# EAGLE design nrf51822-button (EAGLE 7.1.0)
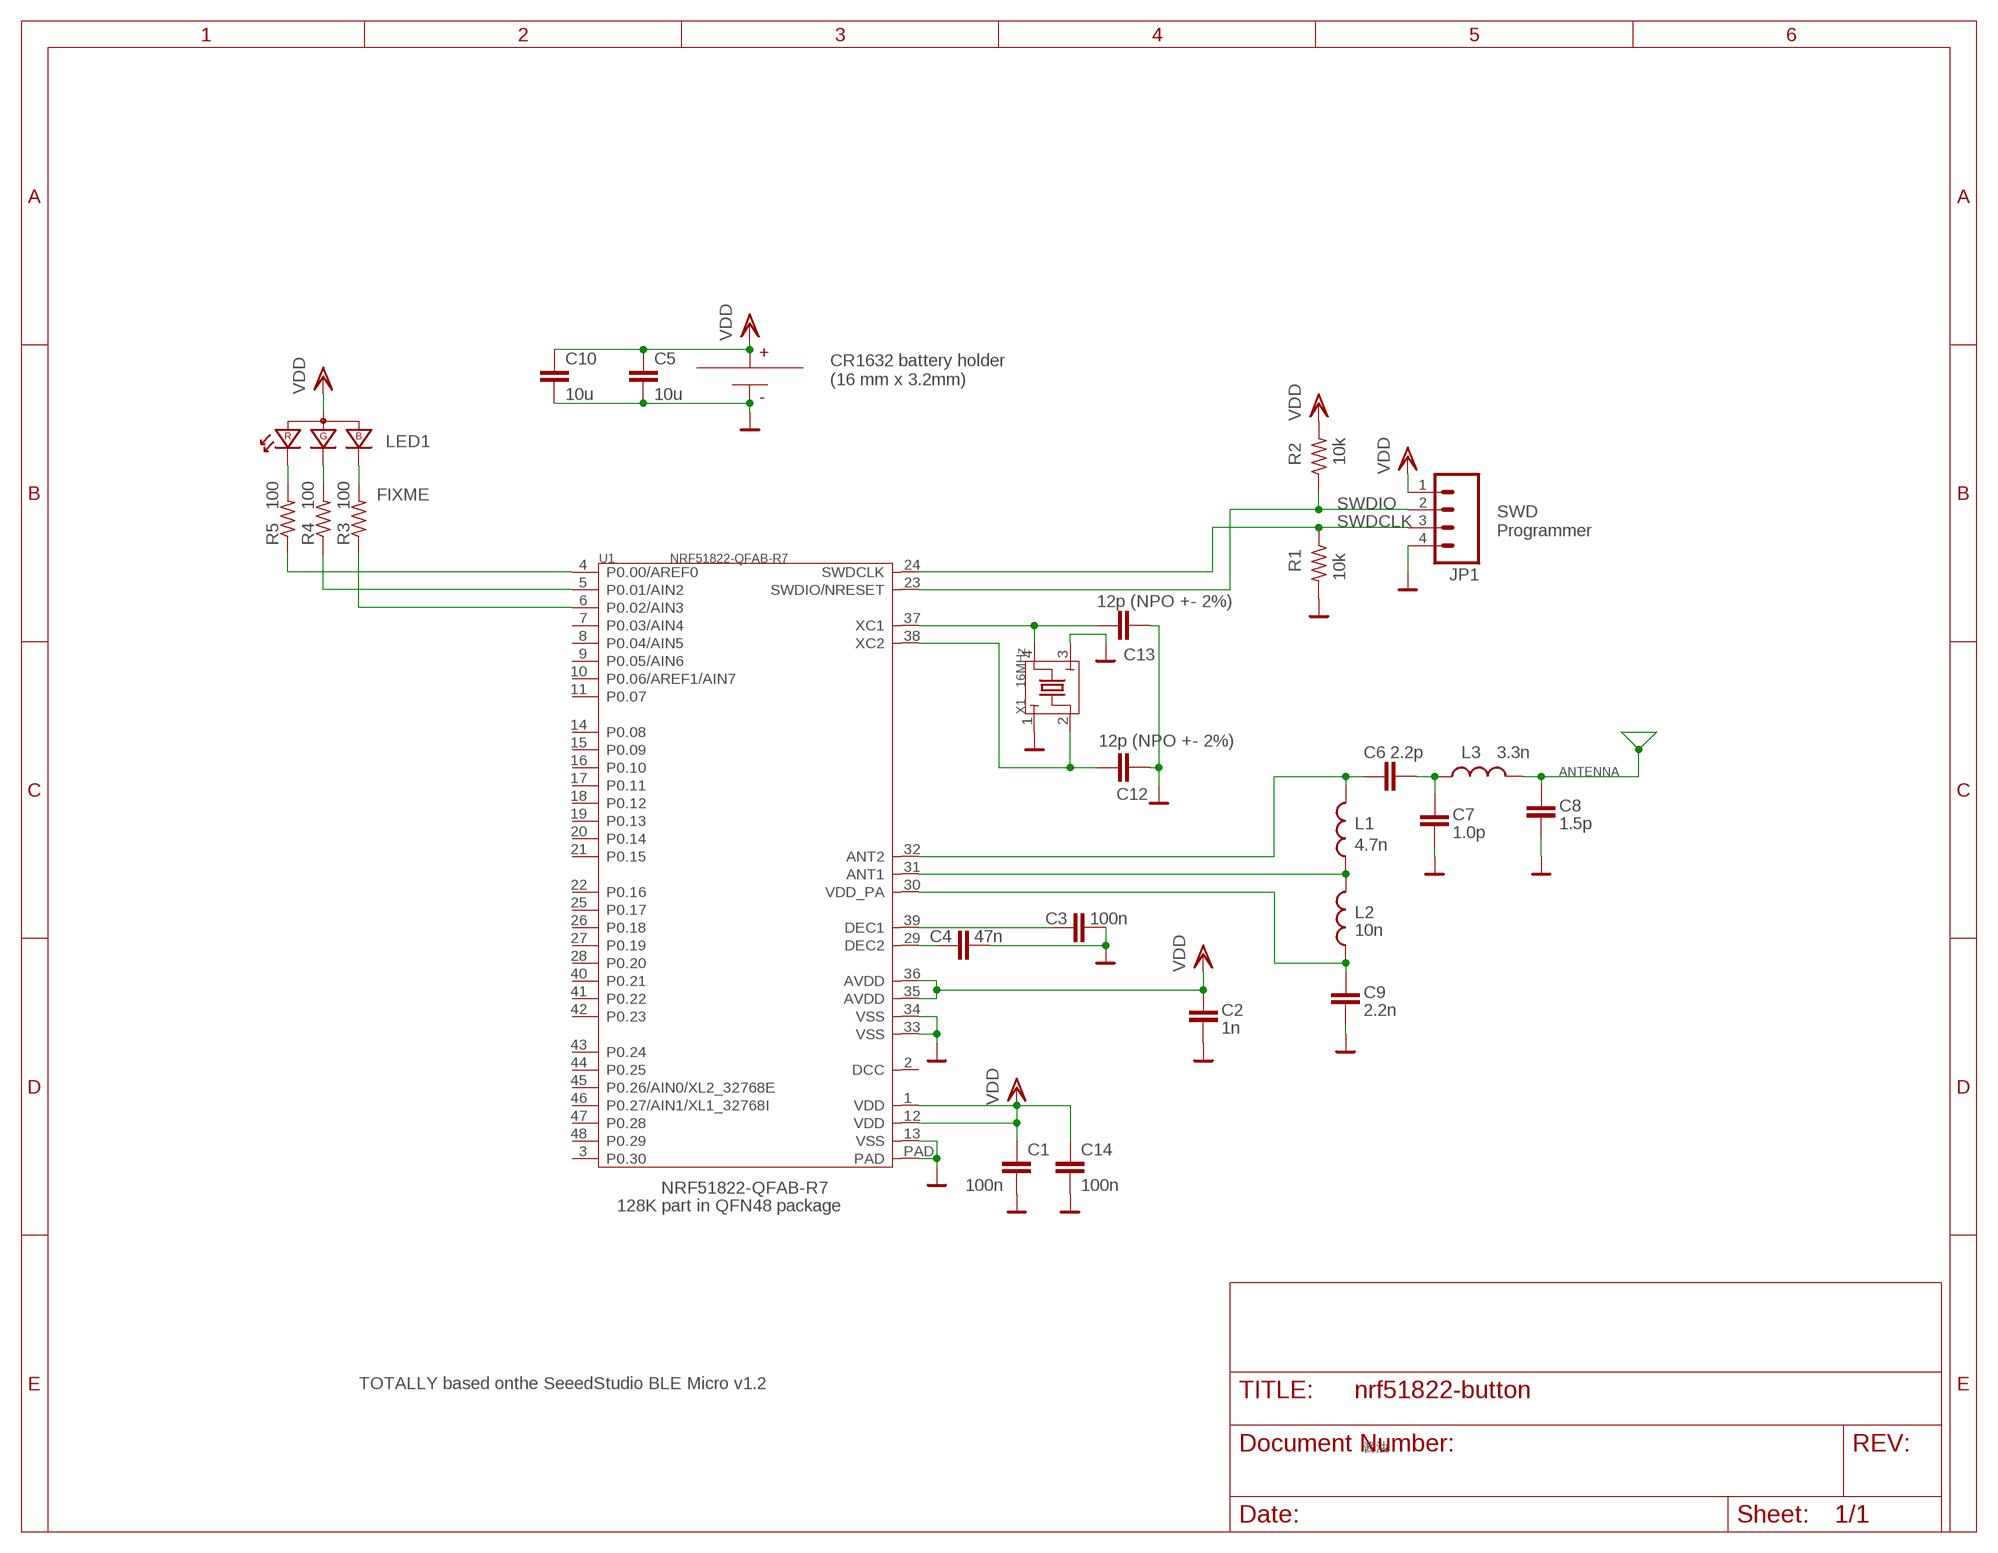
[diagram p0: schematic, sheet 1]

## Parts
B1  CON-COINCEL-HOLDER-KEYSTONE-3012TR  [16MM-COINCELL-KEYSTONE]
C1  100n  C-EU0402-C-NOSILK  [.0402-C-NOSILK]
C2  1n  C-EU0402-C-NOSILK  [.0402-C-NOSILK]
C3  100n  C-EU0402-C-NOSILK  [.0402-C-NOSILK]
C4  47n  C-EU0402-C-NOSILK  [.0402-C-NOSILK]
C5  10u  C-EU0805-B-NOSILK  [.0805-B-NOSILK]
C6  2.2p  C-EU0402-C-NOSILK  [.0402-C-NOSILK]
C7  1.0p  C-EU0402-C-NOSILK  [.0402-C-NOSILK]
C8  1.5p  C-EU0402-C-NOSILK  [.0402-C-NOSILK]
C9  2.2n  C-EU0402-C-NOSILK  [.0402-C-NOSILK]
C10  10u  C-EU0805-B-NOSILK  [.0805-B-NOSILK]
C12  12p (NPO +- 2%)  C-EU0402-C-NOSILK  [.0402-C-NOSILK]
C13  12p (NPO +- 2%)  C-EU0402-C-NOSILK  [.0402-C-NOSILK]
C14  100n  C-EU0402-C-NOSILK  [.0402-C-NOSILK]
JP1  M041.27MM  [1X04-1.27MM]
L1  4.7n  L-US0402-C-NOSILK  [.0402-C-NOSILK]
L2  10n  L-US0402-C-NOSILK  [.0402-C-NOSILK]
L3  3.3n  L-US0402-C-NOSILK  [.0402-C-NOSILK]
LED1  LED_RGB_COMMON_ANODE-1.6X1.26  [KINGBRITE_RGBLED_1.6X1.26]
R1  10k  R-US_0402-C-NOSILK  [.0402-C-NOSILK]
R2  10k  R-US_0402-C-NOSILK  [.0402-C-NOSILK]
R3  100  R-US_0402-C-NOSILK  [.0402-C-NOSILK]
R4  100  R-US_0402-C-NOSILK  [.0402-C-NOSILK]
R5  100  R-US_0402-C-NOSILK  [.0402-C-NOSILK]
U1  NRF51822-QFAB-R7  NRF51822  [QFN48-6X6MM]
X1  16MHz  CRYSTAL'-2520'  [2520]

## Nets
ANTENNA: C8.2 L3.2
GND: B1.NEG C1.2 C2.2 C3.2 C4.2 C5.2 C7.1 C8.1 C9.2 C10.2 C12.2 C13.2 C14.2 JP1.4 R1.2 U1.13(VSS) U1.33(VSS) U1.34(VSS) U1.PAD X1.1 X1.3
N$1: R5.1 U1.4(P0.00/AREF0)
N$2: R4.1 U1.5(P0.01/AIN2)
N$3: R3.1 U1.6(P0.02/AIN3)
N$4: LED1.3(RK) R5.2
N$5: LED1.4(GK) R4.2
N$7: LED1.1(BK) R3.2
N$17: C13.1 U1.37(XC1) X1.4
N$18: C12.1 U1.38(XC2) X1.2
N$19: C3.1 U1.39(DEC1)
N$20: C4.1 U1.29(DEC2)
N$21: C6.1 L1.2 U1.32(ANT2)
N$25: L1.1 L2.2 U1.31(ANT1)
N$26: C9.1 L2.1 U1.30(VDD_PA)
N$28: C6.2 C7.2 L3.1
SWDCLK: JP1.3 R1.1 U1.24(SWDCLK)
SWDIO: JP1.2 R2.1 U1.23(SWDIO/NRESET)
VDD: B1.POS@1(POS) B1.POS@2(POS) C1.1 C2.1 C5.1 C10.1 C14.1 JP1.1 LED1.2(COMMON_ANODE) R2.2 U1.1(VDD) U1.12(VDD) U1.35(AVDD) U1.36(AVDD)
Unconnected: U1.2(DCC) U1.3(P0.30) U1.7(P0.03/AIN4) U1.8(P0.04/AIN5) U1.9(P0.05/AIN6) U1.10(P0.06/AREF1/AIN7) U1.11(P0.07) U1.14(P0.08) U1.15(P0.09) U1.16(P0.10) U1.17(P0.11) U1.18(P0.12) U1.19(P0.13) U1.20(P0.14) U1.21(P0.15) U1.22(P0.16) U1.25(P0.17) U1.26(P0.18) U1.27(P0.19) U1.28(P0.20) U1.40(P0.21) U1.41(P0.22) U1.42(P0.23) U1.43(P0.24) U1.44(P0.25) U1.45(P0.26/AIN0/XL2_32768E) U1.46(P0.27/AIN1/XL1_32768I) U1.47(P0.28) U1.48(P0.29)

## Notes on the sheet
- CR1632 battery holder
  (16 mm x 3.2mm)
- FIXME
- SWD
  Programmer
- NRF51822-QFAB-R7
- 128K part in QFN48 package
- TOTALLY based onthe SeeedStudio BLE Micro v1.2
- 酱油

## Library data of the parts
B1 = 16mm-coincell-keystone:CON-COINCEL-HOLDER-KEYSTONE-3012TR
C1-C10 C12-C14 = rcl_custom:C-EU: CAPACITOR, European symbol
JP1 = SparkFun-v5:M04: Header 4 Standard 4-pin 0.1" header. Use with straight break away headers (SKU : PRT-00116), right angle break away headers (PRT-00553), swiss pins (PRT-00743), machine pins (PRT-00117), and female headers (PRT-00115). Molex polarized connector foot print use with SKU : PRT-08231 with associated crimp pins and housings. 1MM SMD Version SKU: PRT-10208
L1-L3 = rcl_custom:L-US: INDUCTOR, American symbol
LED1 = apdm_alt:LED_RGB_COMMON_ANODE-*: RGB LED with comon anode
R1-R5 = rcl_custom:R-US_: RESISTOR, American symbol
U1 = AMLib:NRF51822: Multi-protocol Blutooth 4.0 low energy /2. GHz RF SoC
X1 = AMLib:CRYSTAL

## Net classes
0 default: width 0.102 mm, drill 0.203 mm, clearance 0.102 mm

## Board
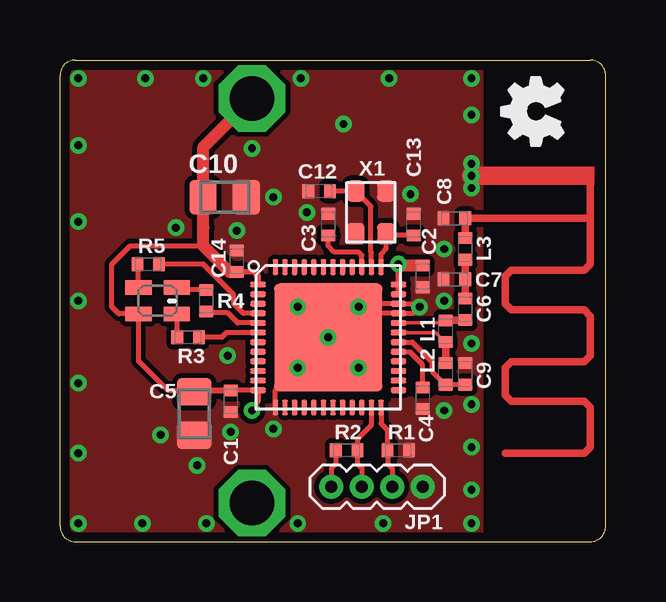
[diagram p1: board, top side]
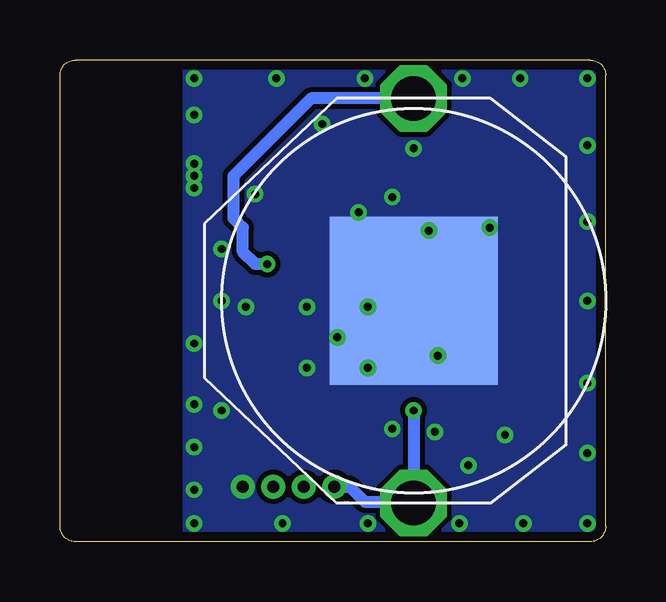
[diagram p2: board, bottom side, seen from below]

Size 22.73 x 20.07 mm. Coordinates in mm from the lower left corner, seen from the top.
Outline: 0.64,0 22.1,0 arc90 22.73,0.64 22.73,19.43 arc90 22.1,20.07 0.64,20.07 arc90 0,19.43 0,0.64 arc90 0.64,0
Copper layers (1*16): Top 0.0356mm / dielectric 1.5011mm / Bottom 0.0356mm
Design rules "OSH-Park-2-layer *": minimum track width 6mil, minimum drill 13mil, track to track 6mil, track to pad 6mil, pad to pad 6mil, via to via 6mil, smd to smd 6mil, copper to edge 15mil, drill to drill 6mil, minimum pad ring 7mil, minimum via ring 7mil, stop-mask expansion 3mil, vias tented up to drill 0mil, thermal gap 10mil
tRestrict: area 8.6,6 to 13.6,10.9; area 13.7,9.5 to 14.5,9.9

### Footprints (pad centres in the part's own frame; a part is rotated, then mirrored left to right if it is on the bottom)
16MM-COINCELL-KEYSTONE = smd 7 x 7: NEG 0,0 | drill 1.85 octagon: POS@1 -8.433,0; POS@2 8.433,0
.0402-C-NOSILK = smd 0.5 x 0.6: 1 -0.45,0; 2 0.45,0
.0805-B-NOSILK = smd 1.15 x 1.45: 1 -0.9,0; 2 0.9,0
1X04-1.27MM = drill 0.508 pad 1: 1 0,0; 2 1.27,0; 3 2.54,0; 4 3.81,0
KINGBRITE_RGBLED_1.6X1.26 = smd 1.1 x 0.6: 1 0.8,-0.55; 2 -0.8,-0.55; 3 -0.8,0.55; 4 0.8,0.55
QFN48-6X6MM = smd 0.23 x 0.65: 1 -2.2,-2.925; 2 -1.8,-2.925; 3 -1.4,-2.925; 4 -1,-2.925; 5 -0.6,-2.925; 6 -0.2,-2.925; 7 0.2,-2.925; 8 0.6,-2.925; 9 1,-2.925; 10 1.4,-2.925; 11 1.8,-2.925; 12 2.2,-2.925; 25 2.2,2.925; 26 1.8,2.925; 27 1.4,2.925; 28 1,2.925; 29 0.6,2.925; 30 0.2,2.925; 31 -0.2,2.925; 32 -0.6,2.925; 33 -1,2.925; 34 -1.4,2.925; 35 -1.8,2.925; 36 -2.2,2.925 | smd 0.65 x 0.23: 13 2.925,-2.2; 14 2.925,-1.8; 15 2.925,-1.4; 16 2.925,-1; 17 2.925,-0.6; 18 2.925,-0.2; 19 2.925,0.2; 20 2.925,0.6; 21 2.925,1; 22 2.925,1.4; 23 2.925,1.8; 24 2.925,2.2; 37 -2.925,2.2; 38 -2.925,1.8; 39 -2.925,1.4; 40 -2.925,1; 41 -2.925,0.6; 42 -2.925,0.2; 43 -2.925,-0.2; 44 -2.925,-0.6; 45 -2.925,-1; 46 -2.925,-1.4; 47 -2.925,-1.8; 48 -2.925,-2.2 | smd 4.5 x 4.5: PAD 0,0
2520 = smd 0.889 x 0.762: 1 -0.889,0.635; 2 -0.889,-0.635; 3 0.889,-0.635; 4 0.889,0.635

### Placement (x,y rotation side)
B1  8,10.03 270 bottom
C1  7.11,5.84 270 top
C2  15.11,11.05 270 top
C3  11.18,13.21 90 top
C4  15.11,5.97 270 top
C5  5.59,5.33 270 top
C6  16.89,9.68 90 top
C7  16.43,10.92 0 top
C8  16.43,13.46 0 top
C9  16.89,6.99 90 top
C10  6.86,14.35 0 top
C12  10.79,14.61 180 top
C13  14.73,13.21 90 top
C14  7.37,11.68 90 top
JP1  11.3,2.29 0 top
L1  16.07,8.76 90 top
L2  16.07,6.99 90 top
L3  16.89,12.19 90 top
LED1  4.06,10.03 0 top
R1  14.1,3.81 0 top
R2  11.94,3.81 180 top
R3  5.33,8.51 180 top
R4  6.1,10.03 90 top
R5  3.68,11.56 180 top
U1  11.18,8.51 270 top
U$31  [OSHW_FILLX100_NOTEXT]  20.95,16.51 90 top
X1  12.95,13.72 270 top

### Tracks (layer width: path | path; a pad name or v marks a point on that pad's centre or on a via)
ANTENNA
  Top 0.305: C8.2 19.3,13.46 | C8.2 L3.2 | C8.2 22.1,13.46 | 22.1,13.46 22.1,11.56 21.84,11.3 18.8,11.3 18.54,11.05 18.54,9.91 18.8,9.65 21.84,9.65 22.1,9.4 22.1,7.75 21.84,7.49 18.8,7.49 18.54,7.24 18.54,6.1 18.8,5.84 21.84,5.84 22.1,5.59 22.1,3.94 21.84,3.68 18.54,3.68 | 22.1,13.46 22.1,15.37
GND  (via drill 0.33 pad 0.61)
  Top 0.152: 13.08,9.91 | 13.1,9.51 13.08,9.53 | 14.73,9.91 14.86,9.78 14.86,9.65
  Top 0.203: 13.08,9.91 U1.34 14.73,9.91 | 13.1,9.51 U1.33 14.72,9.51 14.86,9.65 | U1.13 8.98,6.31 v9.91,7.24
  Top 0.762: 18.8,15.24 v17.14,15.24
  other vias: 10.29,13.72 7.37,12.95 5.71,3.17 11.18,8.51 14.99,9.78 17.14,8.26 12.45,7.24 12.45,9.78 9.91,9.78 16,5.46 17.14,15.75 17.14,14.73 14.61,14.48 17.14,3.94 17.14,5.71 16,12.19 16,10.03 17.14,0.76 9.91,0.76 13.46,0.76 17.14,2.16 6.1,0.76 3.43,0.76 0.76,0.76 0.76,3.68 0.76,6.6 0.76,10.03 0.76,13.34 0.76,19.3 5.97,19.3 10.03,19.3 13.72,19.3 17.14,19.3 17.14,17.78 8.89,4.7 7.11,4.57 0.76,16.51 3.56,19.3 8.89,14.35 4.83,13.08 6.99,7.75 11.81,17.4 8,16.38 4.19,4.45
  pour Top (isolate 0.203, rank 5, no thermals): 17.53,20.07 17.53,0 0,0 0,20.07
  pour Bottom (isolate 0.203, rank 5, no thermals): 17.53,20.07 17.53,0 0,0 0,20.07
N$1
  Top 0.203: U1.4 7.64,9.51 7.24,9.91 7.24,10.29 5.97,11.56 R5.1
N$2
  Top 0.203: U1.5 7.4,9.11 6.99,9.53 6.15,9.53 R4.1
N$3
  Top 0.203: U1.6 6.93,8.71 6.73,8.51 R3.1
N$4
  Top 0.203: R5.2 3.23,10.61 LED1.3
N$5
  Top 0.203: R4.2 4.96,10.48 LED1.4
N$7
  Top 0.203: R3.2 4.88,9.46 LED1.1
N$17
  Top 0.203: U1.37 13.38,11.98 13.59,12.19 X1.4 13.66,12.76 C13.1
N$18
  Top 0.152: 11.51,14.61 C12.1 | 12.98,12.04 12.95,12.06
  Top 0.203: 12.95,12.06 12.95,13.97 X1.2 11.51,14.61 | U1.38 12.98,12.04
N$19
  Top 0.152: 11.43,12.75 C3.1
  Top 0.203: U1.39 12.58,11.94 12.45,12.06 11.43,12.06 11.18,12.32 C3.1
N$20
  Top 0.203: C4.1 15.11,7.37 14.57,7.91 U1.29
N$21
  Top 0.152: U1.32 15.95,9.11 L1.2
  Top 0.305: L1.2 C6.1
N$25
  Top 0.152: U1.31 15.66,8.71 L1.1
  Top 0.305: L1.1 L2.2
N$26
  Top 0.203: C9.1 L2.1 15.49,7.1 15.49,7.49 14.68,8.31 U1.30
N$28
  Top 0.305: C6.2 C7.2 L3.1
SWDCLK
  Top 0.203: U1.24 13.38,4.91 13.65,4.64 R1.1 13.65,3.24 13.84,3.05 JP1.3
SWDIO
  Top 0.203: U1.23 12.98,4.85 12.39,4.26 R2.1 12.39,3.23 12.57,3.05 JP1.2
VDD  (via drill 0.33, 0.33 pad 0.61)
  Top 0.203: v8,5.46 8.25,5.84 U1.12 7.26,6.31 C1.1 | C14.1 7.05,11.24 | 5.97,12.32 2.92,12.32 2.16,11.56 2.16,9.78 2.46,9.48 LED1.2 3.26,7.53 4.5,6.29 5.39,6.29 | U1.35 U1.36 14.1,11.43 v14.1,11.56 | R2.2 11.49,3.23 11.3,3.05 JP1.1 | C5.1 5.71,6.29
  Top 0.229: U1.1 8.25,11.05 8.07,11.23 C14.1
  Top 0.254: C1.1 5.71,6.29 5.39,6.29
  Top 0.508: 7.05,11.24 5.97,12.32 5.97,13.08 | 5.97,13.08 5.97,16.43 B1.POS@1 | C2.1 14.15,11.5 v14.1,11.56 | C10.1 5.96,13.09 5.97,13.08
  Bottom 0.508: v8,5.46 B1.POS@2 8.05,1.65 10.03,1.65 10.67,2.29 JP1.1 | v14.1,11.56 14.61,11.56 15.11,12.06 15.11,13.08 15.49,13.46 15.49,15.24 12.27,18.47 B1.POS@1
(copper drawn outside any net)
  shapes: Top area x1